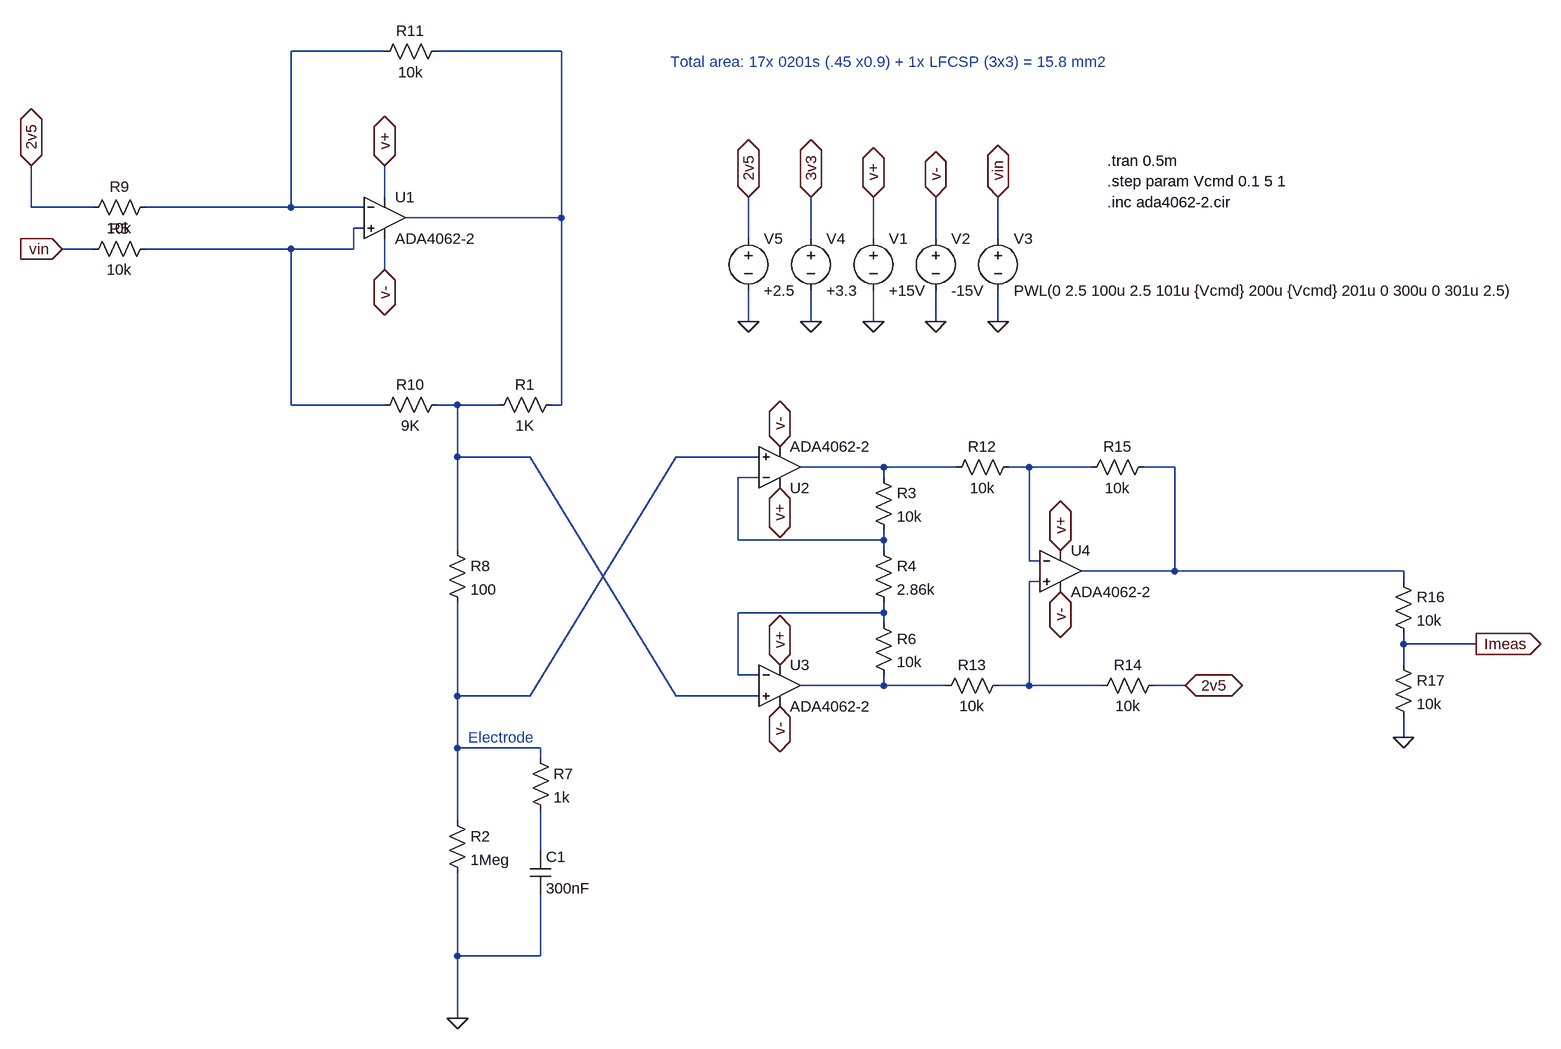
[diagram p0: schematic howland-ADA4062-tran.asc]
howland-ADA4062-tran.asc, the LTspice schematic file:
Version 4
SHEET 1 4076 1332
WIRE 368 -176 224 -176
WIRE 640 -176 448 -176
WIRE 368 48 368 0
WIRE -176 64 -176 0
WIRE -80 64 -176 64
WIRE 224 64 224 -176
WIRE 224 64 0 64
WIRE 336 64 224 64
WIRE 640 80 640 -176
WIRE 640 80 400 80
WIRE 336 96 320 96
WIRE 928 112 928 48
WIRE 1024 112 1024 48
WIRE 1120 112 1120 48
WIRE 1216 112 1216 48
WIRE 1312 112 1312 48
WIRE -80 128 -128 128
WIRE 224 128 0 128
WIRE 320 128 320 96
WIRE 320 128 224 128
WIRE 368 160 368 112
WIRE 928 240 928 192
WIRE 1024 240 1024 192
WIRE 1120 240 1120 192
WIRE 1216 240 1216 192
WIRE 1312 240 1312 192
WIRE 224 368 224 128
WIRE 368 368 224 368
WIRE 480 368 448 368
WIRE 544 368 480 368
WIRE 640 368 640 80
WIRE 640 368 624 368
WIRE 480 448 480 368
WIRE 592 448 480 448
WIRE 944 448 816 448
WIRE 1136 464 1008 464
WIRE 1248 464 1136 464
WIRE 1360 464 1328 464
WIRE 1456 464 1360 464
WIRE 1584 464 1536 464
WIRE 944 480 912 480
WIRE 1136 480 1136 464
WIRE 912 576 912 480
WIRE 1136 576 1136 560
WIRE 1136 576 912 576
WIRE 480 592 480 448
WIRE 1136 592 1136 576
WIRE 1360 608 1360 464
WIRE 1376 608 1360 608
WIRE 1584 624 1584 464
WIRE 1584 624 1440 624
WIRE 1936 624 1584 624
WIRE 1376 640 1360 640
WIRE 1936 640 1936 624
WIRE 1136 688 1136 672
WIRE 1136 688 912 688
WIRE 1136 704 1136 688
WIRE 1936 736 1936 720
WIRE 2048 736 1936 736
WIRE 1936 768 1936 736
WIRE 912 784 912 688
WIRE 944 784 912 784
WIRE 1136 800 1136 784
WIRE 1136 800 1008 800
WIRE 1232 800 1136 800
WIRE 1360 800 1360 640
WIRE 1360 800 1312 800
WIRE 1472 800 1360 800
WIRE 1600 800 1552 800
WIRE 480 816 480 672
WIRE 592 816 816 448
WIRE 592 816 480 816
WIRE 816 816 592 448
WIRE 944 816 816 816
WIRE 1936 880 1936 848
WIRE 480 896 480 816
WIRE 608 896 480 896
WIRE 608 912 608 896
WIRE 480 1008 480 896
WIRE 608 1056 608 992
WIRE 480 1216 480 1088
WIRE 608 1216 608 1120
WIRE 608 1216 480 1216
WIRE 480 1312 480 1216
FLAG -128 128 vin
IOPIN -128 128 In
FLAG 1120 48 v+
IOPIN 1120 48 BiDir
FLAG 1216 48 v-
IOPIN 1216 48 BiDir
FLAG 1216 240 0
FLAG 1120 240 0
FLAG 1312 240 0
FLAG 1312 48 vin
IOPIN 1312 48 BiDir
FLAG 480 1312 0
FLAG 1024 240 0
FLAG 1024 48 3v3
IOPIN 1024 48 BiDir
FLAG 928 240 0
FLAG 928 48 2v5
IOPIN 928 48 BiDir
FLAG -176 0 2v5
IOPIN -176 0 BiDir
FLAG 368 0 v+
IOPIN 368 0 BiDir
FLAG 368 160 v-
IOPIN 368 160 BiDir
FLAG 1600 800 2v5
IOPIN 1600 800 BiDir
FLAG 976 496 v+
IOPIN 976 496 BiDir
FLAG 1408 592 v+
IOPIN 1408 592 BiDir
FLAG 976 768 v+
IOPIN 976 768 BiDir
FLAG 976 432 v-
IOPIN 976 432 BiDir
FLAG 1408 656 v-
IOPIN 1408 656 BiDir
FLAG 976 832 v-
IOPIN 976 832 BiDir
FLAG 2048 736 Imeas
IOPIN 2048 736 Out
FLAG 1936 880 0
SYMBOL res 464 992 R0
SYMATTR InstName R2
SYMATTR Value 1Meg
SYMBOL voltage 1120 96 R0
WINDOW 123 0 0 Left 2
WINDOW 39 0 0 Left 2
SYMATTR InstName V1
SYMATTR Value +15V
SYMBOL voltage 1216 96 R0
WINDOW 123 0 0 Left 2
WINDOW 39 0 0 Left 2
SYMATTR InstName V2
SYMATTR Value -15V
SYMBOL voltage 1312 96 R0
WINDOW 123 0 0 Left 2
WINDOW 39 0 0 Left 2
SYMATTR InstName V3
SYMATTR Value PWL(0 2.5 100u 2.5 101u {Vcmd} 200u {Vcmd} 201u 0 300u 0 301u 2.5)
SYMBOL voltage 1024 96 R0
WINDOW 123 0 0 Left 2
WINDOW 39 0 0 Left 2
SYMATTR InstName V4
SYMATTR Value +3.3
SYMBOL res 16 112 R90
WINDOW 0 0 56 VBottom 2
WINDOW 3 32 56 VTop 2
SYMATTR InstName R5
SYMATTR Value 10k
SYMATTR SpiceLine tol=0.05
SYMBOL voltage 928 96 R0
WINDOW 123 0 0 Left 2
WINDOW 39 0 0 Left 2
SYMATTR InstName V5
SYMATTR Value +2.5
SYMBOL res 592 896 R0
SYMATTR InstName R7
SYMATTR Value 1k
SYMBOL cap 592 1056 R0
SYMATTR InstName C1
SYMATTR Value 300nF
SYMBOL res 464 576 R0
SYMATTR InstName R8
SYMATTR Value 100
SYMATTR SpiceLine tol=1
SYMBOL res 16 48 R90
WINDOW 0 0 56 VBottom 2
WINDOW 3 32 56 VTop 2
SYMATTR InstName R9
SYMATTR Value 10k
SYMATTR SpiceLine tol=0.05
SYMBOL res 464 352 R90
WINDOW 0 0 56 VBottom 2
WINDOW 3 32 56 VTop 2
SYMATTR InstName R10
SYMATTR Value 9K
SYMATTR SpiceLine tol=0.05
SYMBOL res 464 -192 R90
WINDOW 0 0 56 VBottom 2
WINDOW 3 32 56 VTop 2
SYMATTR InstName R11
SYMATTR Value 10k
SYMATTR SpiceLine tol=0.05
SYMBOL res 640 352 R90
WINDOW 0 0 56 VBottom 2
WINDOW 3 32 56 VTop 2
SYMATTR InstName R1
SYMATTR Value 1K
SYMATTR SpiceLine tol=0.05
SYMBOL Opamps\\opamp2 368 16 R0
SYMATTR InstName U1
SYMATTR Value ADA4062-2
SYMBOL Opamps\\opamp2 976 528 M180
SYMATTR InstName U2
SYMATTR Value ADA4062-2
SYMBOL Opamps\\opamp2 976 736 R0
SYMATTR InstName U3
SYMATTR Value ADA4062-2
SYMBOL res 1120 464 R0
SYMATTR InstName R3
SYMATTR Value 10k
SYMBOL res 1120 576 R0
SYMATTR InstName R4
SYMATTR Value 2.86k
SYMBOL res 1120 688 R0
SYMATTR InstName R6
SYMATTR Value 10k
SYMATTR SpiceLine tol=0.05
SYMBOL res 1344 448 R90
WINDOW 0 0 56 VBottom 2
WINDOW 3 32 56 VTop 2
SYMATTR InstName R12
SYMATTR Value 10k
SYMATTR SpiceLine tol=0.05
SYMBOL res 1328 784 R90
WINDOW 0 0 56 VBottom 2
WINDOW 3 32 56 VTop 2
SYMATTR InstName R13
SYMATTR Value 10k
SYMATTR SpiceLine tol=0.05
SYMBOL res 1568 784 R90
WINDOW 0 0 56 VBottom 2
WINDOW 3 32 56 VTop 2
SYMATTR InstName R14
SYMATTR Value 10k
SYMATTR SpiceLine tol=0.05
SYMBOL res 1552 448 R90
WINDOW 0 0 56 VBottom 2
WINDOW 3 32 56 VTop 2
SYMATTR InstName R15
SYMATTR Value 10k
SYMATTR SpiceLine tol=0.05
SYMBOL Opamps\\opamp2 1408 560 R0
SYMATTR InstName U4
SYMATTR Value ADA4062-2
SYMBOL res 1920 624 R0
SYMATTR InstName R16
SYMATTR Value 10k
SYMATTR SpiceLine tol=1
SYMBOL res 1920 752 R0
SYMATTR InstName R17
SYMATTR Value 10k
SYMATTR SpiceLine tol=1
TEXT 1480 -8 Left 2 !.tran 0.5m
TEXT 1480 24 Left 2 !.step param Vcmd 0.1 5 1
TEXT 496 880 Left 2 ;Electrode
TEXT 1480 56 Left 2 !.inc ada4062-2.cir
TEXT 808 -160 Left 2 ;Total area: 17x 0201s (.45 x0.9) + 1x LFCSP (3x3) = 15.8 mm2

The netlist it stands for:
* howland-ADA4062-tran.asc
R2 N005 0 1Meg
V1 v+ 0 +15V
V2 v- 0 -15V
V3 vin 0 PWL(0 2.5 100u 2.5 101u {Vcmd} 200u {Vcmd} 201u 0 300u 0 301u 2.5)
V4 3v3 0 +3.3
R5 N003 vin 10k tol=0.05
V5 2v5 0 +2.5
R7 N005 N013 1k
C1 N013 0 300nF
R8 N004 N005 100 tol=1
R9 N001 2v5 10k tol=0.05
R10 N004 N003 9K tol=0.05
R11 N002 N001 10k tol=0.05
R1 N002 N004 1K tol=0.05
XU1 N003 N001 v+ v- N002 ADA4062-2  ; pins In+ In- V+ V- OUT
XU2 N005 N009 v+ v- N006 ADA4062-2  ; pins In+ In- V+ V- OUT
XU3 N004 N011 v+ v- N012 ADA4062-2  ; pins In+ In- V+ V- OUT
R3 N006 N009 10k
R4 N009 N011 2.86k
R6 N011 N012 10k tol=0.05
R12 N007 N006 10k tol=0.05
R13 N010 N012 10k tol=0.05
R14 2v5 N010 10k tol=0.05
R15 N008 N007 10k tol=0.05
XU4 N010 N007 v+ v- N008 ADA4062-2  ; pins In+ In- V+ V- OUT
R16 N008 Imeas 10k tol=1
R17 Imeas 0 10k tol=1
.tran 0.5m
.step param Vcmd 0.1 5 1
* Electrode
.inc ada4062-2.cir
* Total area: 17x 0201s (.45 x0.9) + 1x LFCSP (3x3) = 15.8 mm2
.backanno
.end